# Altium project Second_Altium_PCB.PrjPcb
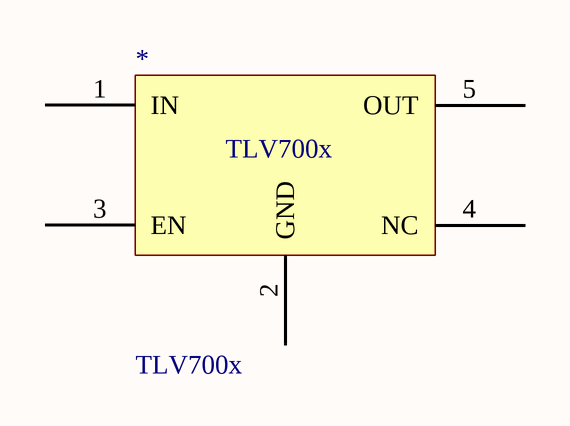
[diagram p0: Master.SchDoc]
1 sheet, 1 parts. Net scope: global (net labels, ports and power ports of the same name join across sheets).

## Sheet Master.SchDoc
size A4; SheetNumber: 1; SheetTotal: 1

### Parts
*  TLV700x  [SOT-23-THIN]

### Nets

Not connected (* = marked no-connect by the designer): * 1(IN) 2(GND) 3(EN) 4(NC) 5(OUT)